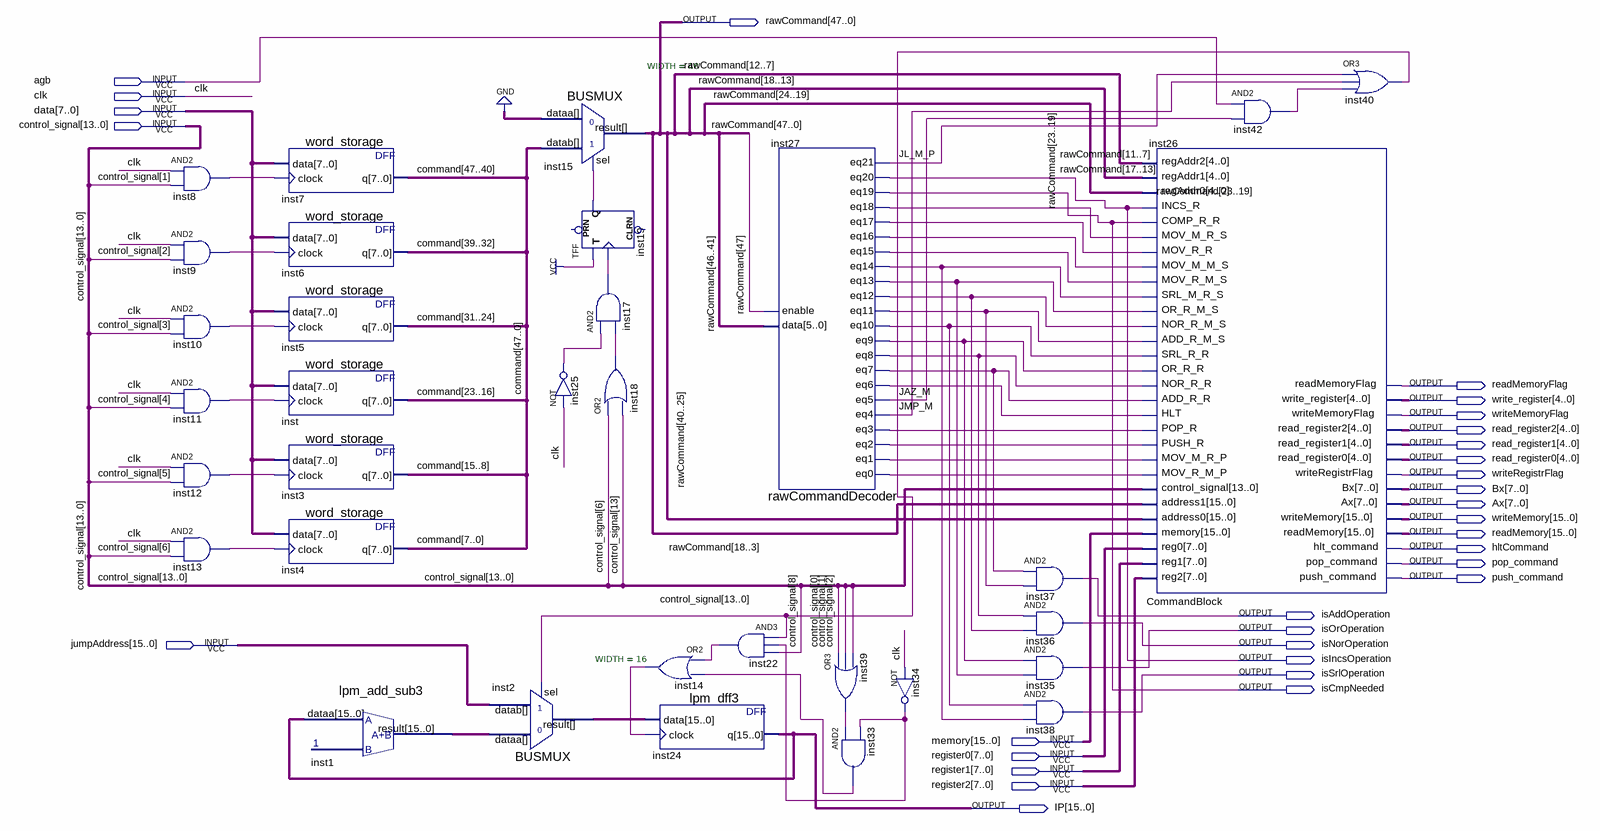
[diagram p0: schematic sheet]
// Quartus schematic ControlBlock.bdf as structural Verilog: 33 symbols, 31 pins
module ControlBlock (
  input  agb,
  input  clk,
  input  [7:0] data,
  input  [13:0] control_signal,
  input  [15:0] jumpAddress,
  input  [15:0] memory,
  input  [7:0] register0,
  input  [7:0] register1,
  input  [7:0] register2,
  output [47:0] rawCommand,
  output readMemoryFlag,
  output [4:0] write_register,
  output writeMemoryFlag,
  output [4:0] read_register2,
  output [4:0] read_register1,
  output [4:0] read_register0,
  output writeRegistrFlag,
  output [7:0] Bx,
  output [7:0] Ax,
  output [15:0] writeMemory,
  output [15:0] readMemory,
  output hltCommand,
  output pop_command,
  output push_command,
  output isAddOperation,
  output isOrOperation,
  output isNorOperation,
  output isIncsOperation,
  output isSrlOperation,
  output isCmpNeeded,
  output [15:0] IP
);

  wire inst8_out, inst9_out, inst10_out, inst11_out, inst12_out, inst13_out, inst14_out, inst17_out,
       inst18_out, inst19_q, inst22_out, inst25_out, inst27_eq0, inst27_eq1, inst27_eq2, inst27_eq3,
       inst27_eq6, inst27_eq7, inst27_eq8, inst27_eq9, inst27_eq10, inst27_eq11, inst27_eq12, inst27_eq13,
       inst27_eq14, inst27_eq15, inst27_eq16, inst27_eq17, inst27_eq18, inst33_out, inst34_out, inst39_out,
       inst40_out, inst42_out, JAZ_M, JL_M_P, JMP_M;
  wire [15:0] inst1_result, inst2_result;
  wire [47:0] command;

  and inst8 (inst8_out, clk, control_signal[1]);
  and inst9 (inst9_out, clk, control_signal[2]);
  and inst10 (inst10_out, clk, control_signal[3]);
  and inst11 (inst11_out, clk, control_signal[4]);
  and inst12 (inst12_out, clk, control_signal[5]);
  and inst13 (inst13_out, clk, control_signal[6]);
  word_storage inst7 (.data(data), .clock(inst8_out), .q(command[47:40]));
  word_storage inst6 (.data(data), .clock(inst9_out), .q(command[39:32]));
  word_storage inst5 (.data(data), .clock(inst10_out), .q(command[31:24]));
  word_storage inst (.data(data), .clock(inst11_out), .q(command[23:16]));
  word_storage inst3 (.data(data), .clock(inst12_out), .q(command[15:8]));
  word_storage inst4 (.data(data), .clock(inst13_out), .q(command[7:0]));
  lpm_add_sub3 inst1 (.dataa(IP), .result(inst1_result));
  BUSMUX #(.WIDTH(16)) inst2 (.datab(jumpAddress), .sel(inst40_out), .dataa(inst1_result), .result(inst2_result));
  BUSMUX #(.WIDTH(48)) inst15 (.datab(command), .sel(inst19_q), .dataa({48{1'b0}}), .result(rawCommand));
  TFF inst19 (.T(1'b1), .CLK(inst17_out), .Q(inst19_q));  // open: PRN, CLRN
  and inst17 (inst17_out, inst25_out, inst18_out);
  not inst25 (inst25_out, clk);
  or inst18 (inst18_out, control_signal[6], control_signal[13]);
  or inst14 (inst14_out, inst22_out, inst33_out);
  lpm_dff3 inst24 (.data(inst2_result), .clock(inst14_out), .q(IP));
  rawCommandDecoder inst27 (
    .data(rawCommand[46:41]), .enable(rawCommand[47]), .eq0(inst27_eq0), .eq1(inst27_eq1), .eq2(inst27_eq2),
    .eq3(inst27_eq3), .eq4(JMP_M), .eq5(JAZ_M), .eq6(inst27_eq6), .eq7(inst27_eq7), .eq8(inst27_eq8),
    .eq9(inst27_eq9), .eq10(inst27_eq10), .eq11(inst27_eq11), .eq12(inst27_eq12), .eq13(inst27_eq13),
    .eq14(inst27_eq14), .eq15(inst27_eq15), .eq16(inst27_eq16), .eq17(inst27_eq17), .eq18(inst27_eq18),
    .eq19(isCmpNeeded), .eq20(isIncsOperation), .eq21(JL_M_P));
  and inst22 (inst22_out, inst40_out, inst34_out, control_signal[8]);
  or inst39 (inst39_out, control_signal[0], control_signal[1], control_signal[2]);
  and inst33 (inst33_out, inst39_out, inst34_out);
  not inst34 (inst34_out, clk);
  and inst37 (isAddOperation, inst27_eq7, inst27_eq11);
  and inst36 (isNorOperation, inst27_eq8, inst27_eq12);
  and inst35 (isOrOperation, inst27_eq9, inst27_eq13);
  and inst38 (isSrlOperation, inst27_eq10, inst27_eq14);
  CommandBlock inst26 (
    .reg2(register2), .reg1(register1), .reg0(register0), .memory(memory), .address0(rawCommand[40:25]),
    .address1(rawCommand[18:3]), .control_signal(control_signal), .MOV_R_M_P(inst27_eq0),
    .MOV_M_R_P(inst27_eq1), .PUSH_R(inst27_eq2), .POP_R(inst27_eq3), .HLT(inst27_eq6), .ADD_R_R(inst27_eq7),
    .NOR_R_R(inst27_eq8), .OR_R_R(inst27_eq9), .SRL_R_R(inst27_eq10), .ADD_R_M_S(inst27_eq11),
    .NOR_R_M_S(inst27_eq12), .OR_R_M_S(inst27_eq13), .SRL_M_R_S(inst27_eq14), .MOV_R_M_S(inst27_eq15),
    .MOV_M_M_S(inst27_eq16), .MOV_R_R(inst27_eq17), .MOV_M_R_S(inst27_eq18), .COMP_R_R(isCmpNeeded),
    .INCS_R(isIncsOperation), .regAddr0(rawCommand[23:19]), .regAddr1(rawCommand[17:13]),
    .regAddr2(rawCommand[11:7]), .push_command(push_command), .pop_command(pop_command),
    .hlt_command(hltCommand), .readMemory(readMemory), .writeMemory(writeMemory), .Ax(Ax), .Bx(Bx),
    .writeRegistrFlag(writeRegistrFlag), .read_register0(read_register0), .read_register1(read_register1),
    .read_register2(read_register2), .writeMemoryFlag(writeMemoryFlag), .write_register(write_register),
    .readMemoryFlag(readMemoryFlag));
  and inst42 (inst42_out, agb, JAZ_M);
  or inst40 (inst40_out, JL_M_P, JMP_M, inst42_out);
endmodule
